# Altium schematic sheet Main.SchDoc
size A
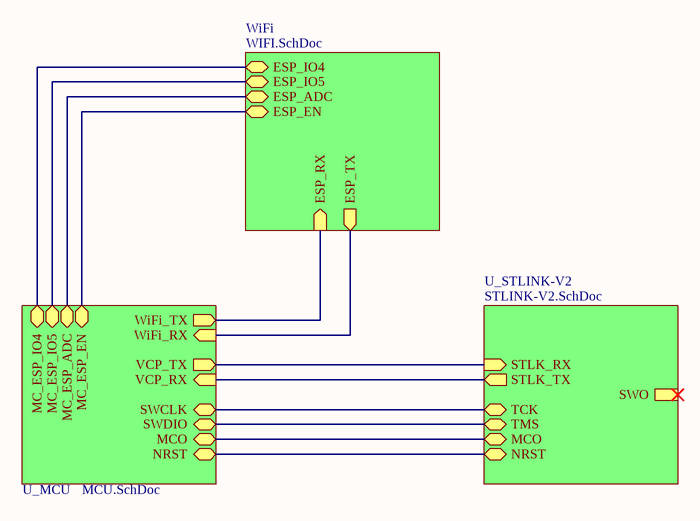
[diagram p0: Main.SchDoc]

## Sub-sheets
U_MCU = MCU.SchDoc: VCP_TX (out), VCP_RX (in), SWCLK (bidir), SWDIO (bidir), MCO (bidir), NRST (bidir), WiFi_TX (out), WiFi_RX (in), MC_ESP_IO4 (bidir), MC_ESP_IO5 (bidir), MC_ESP_ADC (bidir), MC_ESP_EN (bidir)
U_STLINK-V2 = STLINK-V2.SchDoc: STLK_RX (in), STLK_TX (out), TCK (bidir), TMS (bidir), MCO (bidir), NRST (bidir), SWO
WiFi = WIFI.SchDoc: ESP_RX (in), ESP_TX (out), ESP_IO4 (bidir), ESP_IO5 (bidir), ESP_ADC (bidir), ESP_EN (bidir)

## Nets
(unnamed): sheet U_MCU/VCP_TX, sheet U_STLINK-V2/STLK_RX
(unnamed): sheet U_MCU/VCP_RX, sheet U_STLINK-V2/STLK_TX
(unnamed): sheet U_MCU/SWCLK, sheet U_STLINK-V2/TCK
(unnamed): sheet U_MCU/SWDIO, sheet U_STLINK-V2/TMS
(unnamed): sheet U_MCU/MCO, sheet U_STLINK-V2/MCO
(unnamed): sheet U_MCU/NRST, sheet U_STLINK-V2/NRST
(unnamed): sheet U_MCU/WiFi_TX, sheet WiFi/ESP_RX
(unnamed): sheet U_MCU/WiFi_RX, sheet WiFi/ESP_TX
(unnamed): sheet U_MCU/MC_ESP_IO4, sheet WiFi/ESP_IO4
(unnamed): sheet U_MCU/MC_ESP_IO5, sheet WiFi/ESP_IO5
(unnamed): sheet U_MCU/MC_ESP_ADC, sheet WiFi/ESP_ADC
(unnamed): sheet U_MCU/MC_ESP_EN, sheet WiFi/ESP_EN